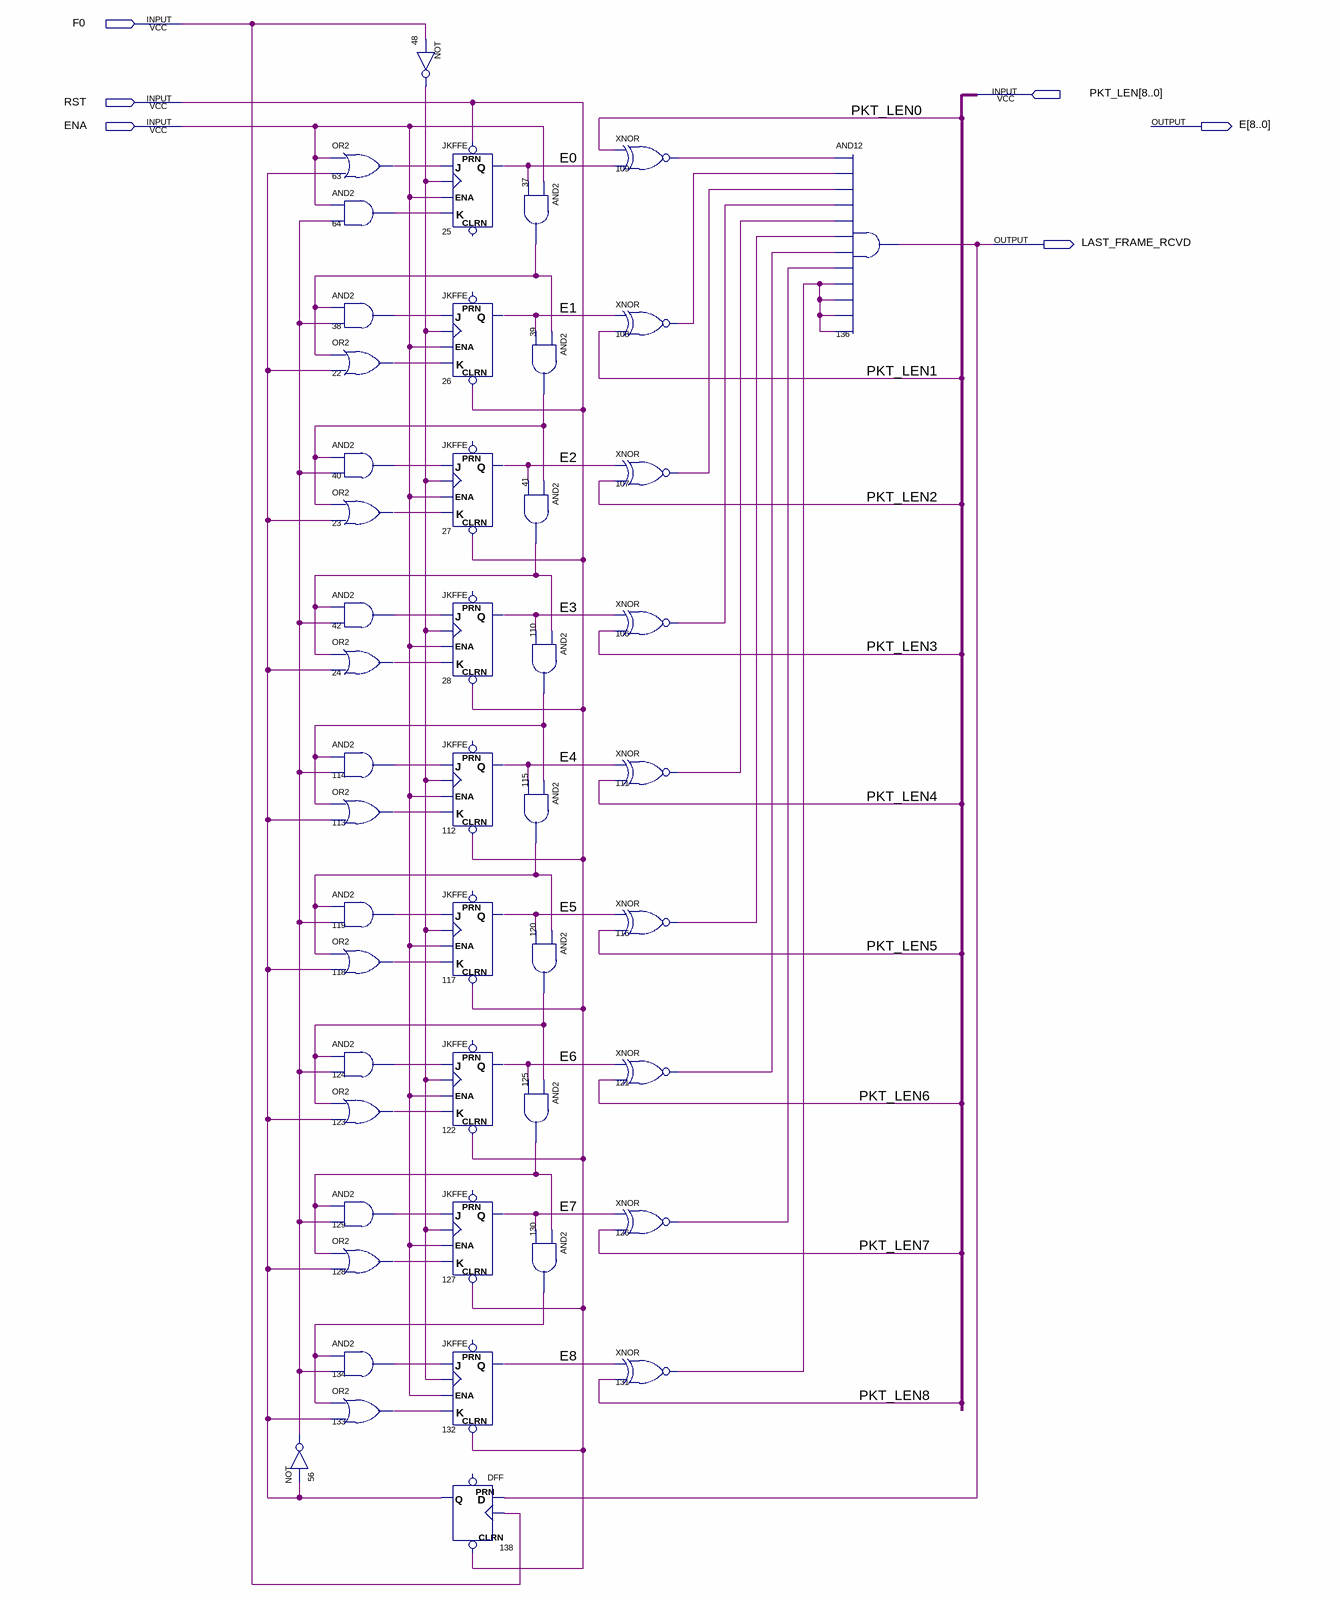
[diagram p0: schematic sheet]
// Quartus schematic stbus_ctrl3.bdf as structural Verilog: 48 symbols, 6 pins
module stbus_ctrl3 (
  input  F0,
  input  [8:0] PKT_LEN,
  input  RST,
  input  ENA,
  output [8:0] E,
  output LAST_FRAME_RCVD
);

  wire n22_out, n23_out, n24_out, n37_out, n38_out, n39_out, n40_out, n41_out, n42_out, n48_out, n56_out,
       n63_out, n64_out, n106_out, n107_out, n108_out, n109_out, n110_out, n111_out, n113_out, n114_out,
       n115_out, n116_out, n118_out, n119_out, n120_out, n121_out, n123_out, n124_out, n125_out, n126_out,
       n128_out, n129_out, n130_out, n131_out, n133_out, n134_out, n138_q;

  or u_63 (n63_out, ENA, n138_q);
  and u_64 (n64_out, ENA, n56_out);
  and u_38 (n38_out, n37_out, n56_out);
  or u_22 (n22_out, n37_out, n138_q);
  and u_40 (n40_out, n39_out, n56_out);
  or u_23 (n23_out, n39_out, n138_q);
  and u_42 (n42_out, n41_out, n56_out);
  or u_24 (n24_out, n41_out, n138_q);
  and u_114 (n114_out, n110_out, n56_out);
  or u_113 (n113_out, n110_out, n138_q);
  and u_119 (n119_out, n115_out, n56_out);
  or u_118 (n118_out, n115_out, n138_q);
  and u_124 (n124_out, n120_out, n56_out);
  or u_123 (n123_out, n120_out, n138_q);
  and u_129 (n129_out, n125_out, n56_out);
  or u_128 (n128_out, n125_out, n138_q);
  and u_134 (n134_out, n130_out, n56_out);
  or u_133 (n133_out, n130_out, n138_q);
  not u_56 (n56_out, n138_q);
  not u_48 (n48_out, F0);
  JKFFE u_25 (.PRN(RST), .J(n63_out), .CLK(n48_out), .K(n64_out), .ENA(ENA), .Q(E[0]));  // open: CLRN
  JKFFE u_26 (.J(n38_out), .CLK(n48_out), .CLRN(RST), .K(n22_out), .ENA(ENA), .Q(E[1]));  // open: PRN
  JKFFE u_27 (.J(n40_out), .CLK(n48_out), .CLRN(RST), .K(n23_out), .ENA(ENA), .Q(E[2]));  // open: PRN
  JKFFE u_28 (.J(n42_out), .CLK(n48_out), .CLRN(RST), .K(n24_out), .ENA(ENA), .Q(E[3]));  // open: PRN
  JKFFE u_112 (.J(n114_out), .CLK(n48_out), .CLRN(RST), .K(n113_out), .ENA(ENA), .Q(E[4]));  // open: PRN
  JKFFE u_117 (.J(n119_out), .CLK(n48_out), .CLRN(RST), .K(n118_out), .ENA(ENA), .Q(E[5]));  // open: PRN
  JKFFE u_122 (.J(n124_out), .CLK(n48_out), .CLRN(RST), .K(n123_out), .ENA(ENA), .Q(E[6]));  // open: PRN
  JKFFE u_127 (.J(n129_out), .CLK(n48_out), .CLRN(RST), .K(n128_out), .ENA(ENA), .Q(E[7]));  // open: PRN
  JKFFE u_132 (.J(n134_out), .CLK(n48_out), .CLRN(RST), .K(n133_out), .ENA(ENA), .Q(E[8]));  // open: PRN
  DFF u_138 (.CLRN(RST), .CLK(F0), .D(LAST_FRAME_RCVD), .Q(n138_q));  // open: PRN
  and u_37 (n37_out, ENA, E[0]);
  and u_39 (n39_out, n37_out, E[1]);
  and u_41 (n41_out, n39_out, E[2]);
  and u_110 (n110_out, n41_out, E[3]);
  and u_115 (n115_out, n110_out, E[4]);
  and u_120 (n120_out, n115_out, E[5]);
  and u_125 (n125_out, n120_out, E[6]);
  and u_130 (n130_out, n125_out, E[7]);
  xnor u_109 (n109_out, PKT_LEN[0], E[0]);
  xnor u_108 (n108_out, E[1], PKT_LEN[1]);
  xnor u_107 (n107_out, E[2], PKT_LEN[2]);
  xnor u_106 (n106_out, E[3], PKT_LEN[3]);
  xnor u_111 (n111_out, E[4], PKT_LEN[4]);
  xnor u_116 (n116_out, E[5], PKT_LEN[5]);
  xnor u_121 (n121_out, E[6], PKT_LEN[6]);
  xnor u_126 (n126_out, E[7], PKT_LEN[7]);
  xnor u_131 (n131_out, E[8], PKT_LEN[8]);
  and u_136 (LAST_FRAME_RCVD, n109_out, n108_out, n107_out, n106_out, n111_out, n116_out, n121_out, n126_out, n131_out, n131_out, n131_out, n131_out);
endmodule
